# Altium schematic sheet 转接板V01.SchDoc
size A4
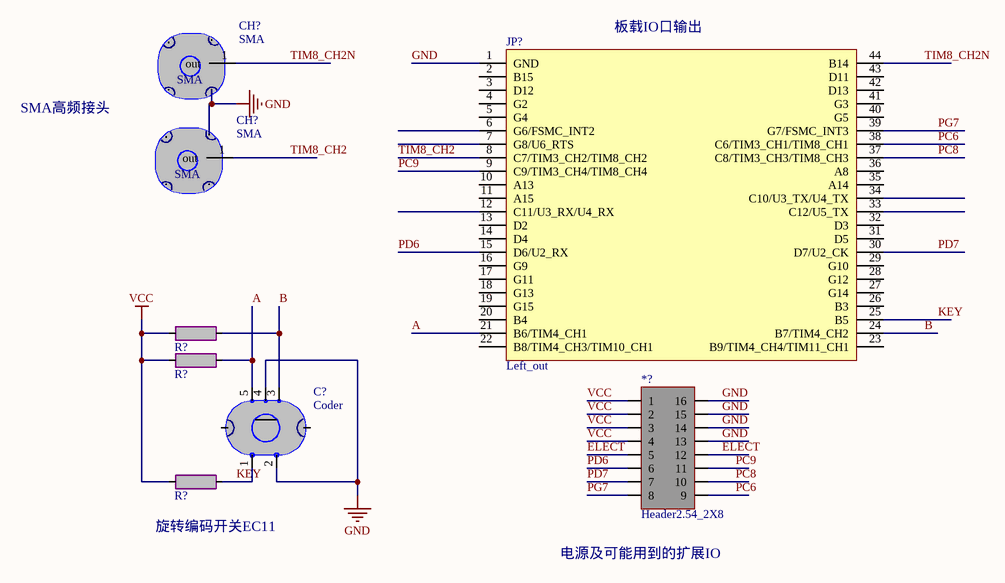
[diagram p0: 转接板V01.SchDoc]

## Parts
(Parts that share a designator on the sheet are numbered #1, #2 ... from top to bottom, then left to right.)
*?  Header2.54_2X8  [Header 2.54_2X8]
C?  Coder  [Coder]
CH?#1  SMA  [SMA]
CH?#2  SMA  [SMA]
JP?  Left_out  [Header2.54_2X22]
R?#1  RES_0805  [0805_R]  (value not drawn)
R?#2  RES_0805  [0805_R]  (value not drawn)
R?#3  RES_0805  [0805_R]  (value not drawn)

## Nets
GND: *?.13 *?.14 *?.15 *?.16 C?.2(GND) C?.4(GND) CH?#1.0(hole) CH?#2.0(hole) JP?.1(GND)
VCC: *?.1 *?.2 *?.3 *?.4 R?#1.2 R?#2.2 R?#3.2
A: C?.5(A) JP?.21(B6/TIM4_CH1) R?#2.1
B: C?.3(B) JP?.24(B7/TIM4_CH2) R?#1.1
ELECT: *?.5 *?.12
KEY: C?.1(key) JP?.25(B5) R?#3.1
PC6: *?.9 JP?.38(C6/TIM3_CH1/TIM8_CH1)
PC8: *?.10 JP?.37(C8/TIM3_CH3/TIM8_CH3)
PC9: *?.11 JP?.9(C9/TIM3_CH4/TIM8_CH4)
PD6: *?.6 JP?.15(D6/U2_RX)
PD7: *?.7 JP?.30(D7/U2_CK)
PG7: *?.8 JP?.39(G7/FSMC_INT3)
TIM8_CH2: CH?#2.1(out) JP?.8(C7/TIM3_CH2/TIM8_CH2)
TIM8_CH2N: CH?#1.1(out) JP?.44(B14)

Not connected (* = marked no-connect by the designer): C? 0(hole); JP? 2(B15) 3(D12) 4(G2) 5(G4) 6(G6/FSMC_INT2) 7(G8/U6_RTS) 10(A13) 11(A15) 12(C11/U3_RX/U4_RX) 13(D2) 14(D4) 16(G9) 17(G11) 18(G13) 19(G15) 20(B4) 22(B8/TIM4_CH3/TIM10_CH1) 23(B9/TIM4_CH4/TIM11_CH1) 26(B3) 27(G14) 28(G12) 29(G10) 31(D5) 32(D3) 33(C12/U5_TX) 34(C10/U3_TX/U4_TX) 35(A14) 36(A8) 40(G5) 41(G3) 42(D13) 43(D11)

## Notes on the sheet
- (near JP?) 板载IO口输出
- SMA高频接头
- (near R?#3) 旋转编码开关EC11
- (near *?) 电源及可能用到的扩展IO

## Library data of the parts
R?#1-R?#3 = RES_0805: 贴片电阻，0805封装